# Altium project zytek_gatedrv.PRJPCB
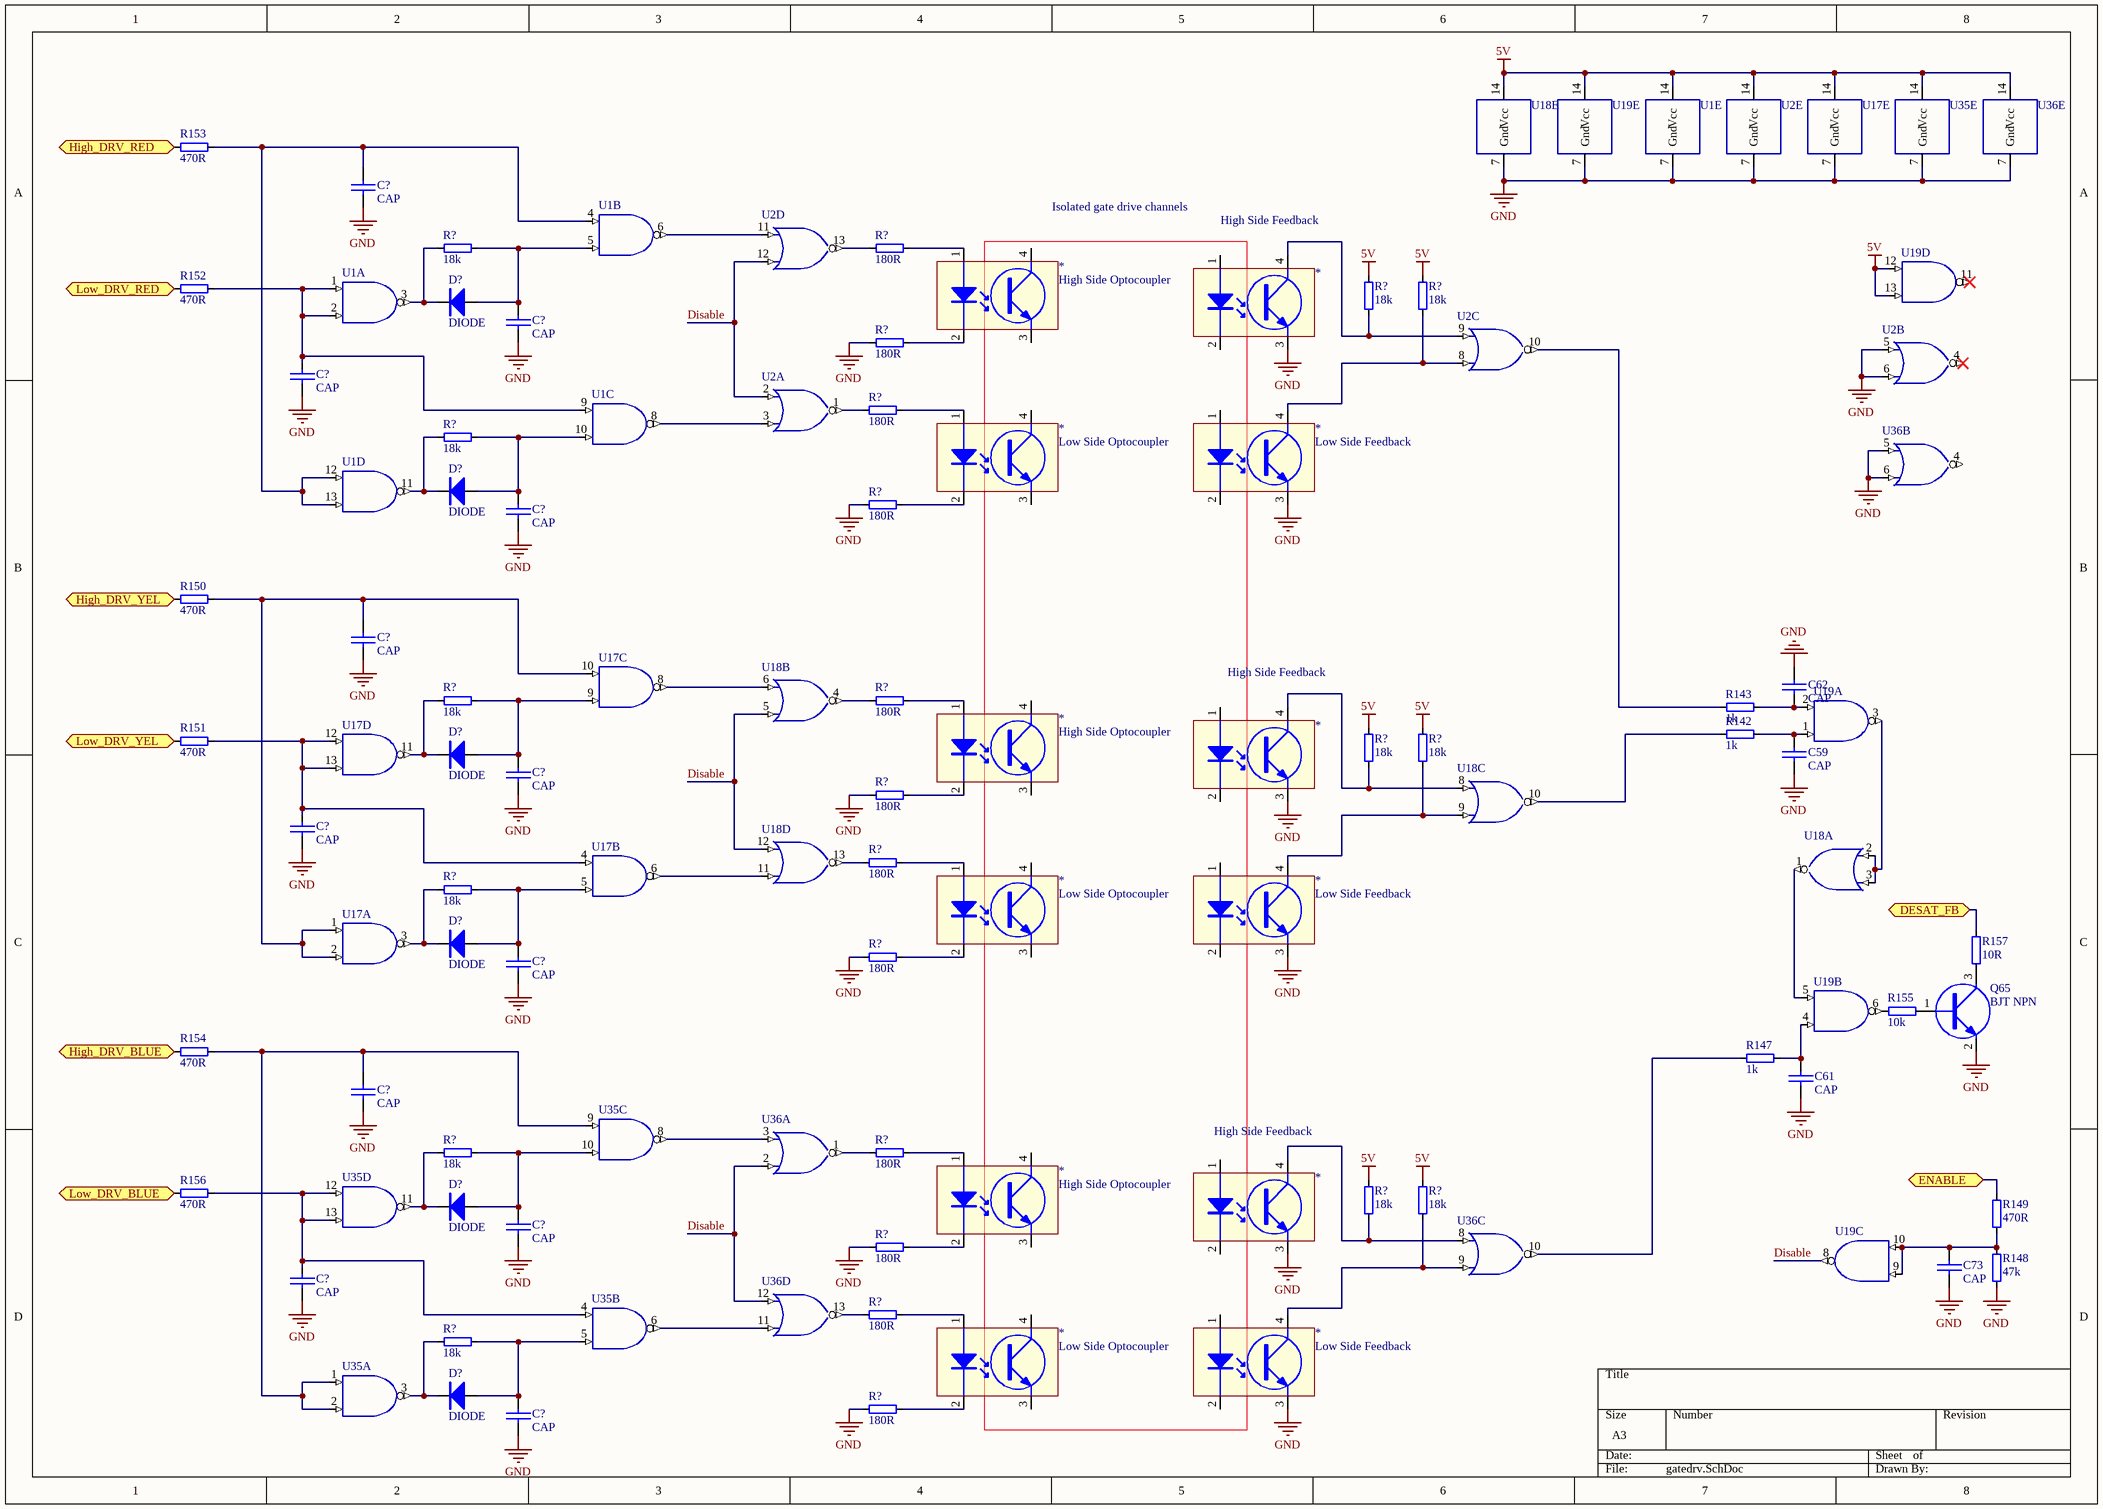
[diagram p0: gatedrv.SchDoc]
DOC_NAME: BLDC CONVERTER PCB; PCB_REV: V5.0; PROJECT_NAME: BLDC CONVERTER PCB; SCH_REV: V5.0
2 sheets, 86 parts. Net scope: flat (ports and power ports of the same name join across sheets).
Sheets:
  gatedrv.SchDoc
  connector.SchDoc

## Sheet gatedrv.SchDoc
size A3; PageSetup: Record=PageOptions|CenterHorizontal=True|CenterVertical=True|PrintScale=0.73|XCorrection=1.00|YCorrection=1.00|PrintKind=1|BorderSize=5000000|LeftOffset=0|BottomOffset=0|Orientation=2|PaperLength=1000|PaperWidth=1000|Scale=100|PaperSource=7|PrintQuality=-3|MediaType=1|DitherType=10|PrintScaleMode=1|PaperKind=A4|PaperIndex=9

### Parts
(Parts that share a designator on the sheet are numbered #1, #2 ... from top to bottom, then left to right.)
*#1  High Side Optocoupler  [4_SMD_GULLWING]
*#2  High Side Feedback  [4_SMD_GULLWING]
*#3  Low Side Optocoupler  [4_SMD_GULLWING]
*#4  Low Side Feedback  [4_SMD_GULLWING]
*#5  High Side Optocoupler  [4_SMD_GULLWING]
*#6  High Side Feedback  [4_SMD_GULLWING]
*#7  Low Side Optocoupler  [4_SMD_GULLWING]
*#8  Low Side Feedback  [4_SMD_GULLWING]
*#9  High Side Optocoupler  [4_SMD_GULLWING]
*#10  High Side Feedback  [4_SMD_GULLWING]
*#11  Low Side Optocoupler  [4_SMD_GULLWING]
*#12  Low Side Feedback  [4_SMD_GULLWING]
C59  CAP  [0402]
C61  CAP  [0402]
C62  CAP  [0402]
C73  CAP  [0402]
C?#1  CAP  [0402]
C?#2  CAP  [0402]
C?#3  CAP  [0402]
C?#4  CAP  [0402]
C?#5  CAP  [0402]
C?#6  CAP  [0402]
C?#7  CAP  [0402]
C?#8  CAP  [0402]
C?#9  CAP  [0402]
C?#10  CAP  [0402]
C?#11  CAP  [0402]
C?#12  CAP  [0402]
D?#1  DIODE  [D-0603]
D?#2  DIODE  [D-0603]
D?#3  DIODE  [D-0603]
D?#4  DIODE  [D-0603]
D?#5  DIODE  [D-0603]
D?#6  DIODE  [D-0603]
Q65  BJT NPN  [SOT23]
R142  1k  [0402]
R143  1k  [0402]
R147  1k  [0402]
R148  47k  [0402]
R149  470R  [0402]
R150  470R  [0402]
R151  470R  [0402]
R152  470R  [0402]
R153  470R  [0402]
R154  470R  [0402]
R155  10k  [0402]
R156  470R  [0402]
R157  10R  [0402]
R?#1  18k  [0402]
R?#2  180R  [0402]
R?#3  18k  [0402]
R?#4  18k  [0402]
R?#5  180R  [0402]
R?#6  180R  [0402]
R?#7  18k  [0402]
R?#8  180R  [0402]
R?#9  18k  [0402]
R?#10  180R  [0402]
R?#11  18k  [0402]
R?#12  18k  [0402]
R?#13  180R  [0402]
R?#14  180R  [0402]
R?#15  18k  [0402]
R?#16  180R  [0402]
R?#17  18k  [0402]
R?#18  180R  [0402]
R?#19  18k  [0402]
R?#20  18k  [0402]
R?#21  180R  [0402]
R?#22  180R  [0402]
R?#23  18k  [0402]
R?#24  180R  [0402]
U1  (no value)  [SO14]  (parts A,B,C,D,E of 5)
U2  (no value)  [SO14]  (parts A,B,C,D,E of 5)
U17  (no value)  [SO14]  (parts A,B,C,D,E of 5)
U18  (no value)  [SO14]  (parts A,B,C,D,E of 5)
U19  (no value)  [SO14]  (parts A,B,C,D,E of 5)
U35  (no value)  [SO14]  (parts A,B,C,D,E of 5)
U36  (no value)  [SO14]  (parts A,B,C,D,E of 5)

### Ports
DESAT_FB, ENABLE, High_DRV_BLUE, High_DRV_RED, High_DRV_YEL, Low_DRV_BLUE, Low_DRV_RED, Low_DRV_YEL

### Nets
5V: R?#3.2 R?#4.2 R?#11.2 R?#12.2 R?#19.2 R?#20.2 U1.14(Vcc) U2.14(Vcc) U17.14(Vcc) U18.14(Vcc) U19.12 U19.13 U19.14(Vcc) U35.14(Vcc) U36.14(Vcc)
GND: *#2.3 *#4.3 *#6.3 *#8.3 *#10.3 *#12.3 C59.1 C61.1 C62.2 C73.1 C?#1.1 C?#2.1 C?#3.2 C?#4.1 C?#5.1 C?#6.1 C?#7.2 C?#8.1 C?#9.1 C?#10.1 C?#11.2 C?#12.1 Q65.2(E) R148.2 R?#5.2 R?#8.2 R?#13.2 R?#16.2 R?#21.2 R?#24.2 U1.7(Gnd) U2.5 U2.6 U2.7(Gnd) U17.7(Gnd) U18.7(Gnd) U19.7(Gnd) U35.7(Gnd) U36.5 U36.6 U36.7(Gnd)
Disable: U2.2 U2.12 U18.5 U18.12 U19.8 U36.2 U36.12
Net*#1_1: *#1.1 R?#2.2
Net*#1_2: *#1.2 R?#5.1
Net*#2_4: *#2.4 R?#3.1 U2.9
Net*#3_1: *#3.1 R?#6.2
Net*#3_2: *#3.2 R?#8.1
Net*#4_4: *#4.4 R?#4.1 U2.8
Net*#5_1: *#5.1 R?#10.2
Net*#5_2: *#5.2 R?#13.1
Net*#6_4: *#6.4 R?#11.1 U18.8
Net*#7_1: *#7.1 R?#14.2
Net*#7_2: *#7.2 R?#16.1
Net*#8_4: *#8.4 R?#12.1 U18.9
Net*#9_1: *#9.1 R?#18.2
Net*#9_2: *#9.2 R?#21.1
Net*#10_4: *#10.4 R?#19.1 U36.8
Net*#11_1: *#11.1 R?#22.2
Net*#11_2: *#11.2 R?#24.1
Net*#12_4: *#12.4 R?#20.1 U36.9
NetC59_2: C59.2 R142.2 U19.1
NetC61_2: C61.2 R147.2 U19.4
NetC62_1: C62.1 R143.2 U19.2
NetC73_2: C73.2 R148.1 R149.2 U19.9 U19.10
NetC?#1_2: C?#1.2 R153.2 U1.4 U1.12 U1.13
NetC?#2_2: C?#2.2 D?#1.A R?#1.2 U1.5
NetC?#3_1: C?#3.1 R152.2 U1.1 U1.2 U1.9
NetC?#4_2: C?#4.2 D?#2.A R?#7.2 U1.10
NetC?#5_2: C?#5.2 R150.2 U17.1 U17.2 U17.10
NetC?#6_2: C?#6.2 D?#3.A R?#9.2 U17.9
NetC?#7_1: C?#7.1 R151.2 U17.4 U17.12 U17.13
NetC?#8_2: C?#8.2 D?#4.A R?#15.2 U17.5
NetC?#9_2: C?#9.2 R154.2 U35.1 U35.2 U35.9
NetC?#10_2: C?#10.2 D?#5.A R?#17.2 U35.10
NetC?#11_1: C?#11.1 R156.2 U35.4 U35.12 U35.13
NetC?#12_2: C?#12.2 D?#6.A R?#23.2 U35.5
NetD?#1_K: D?#1.K R?#1.1 U1.3
NetD?#2_K: D?#2.K R?#7.1 U1.11
NetD?#3_K: D?#3.K R?#9.1 U17.11
NetD?#4_K: D?#4.K R?#15.1 U17.3
NetD?#5_K: D?#5.K R?#17.1 U35.11
NetD?#6_K: D?#6.K R?#23.1 U35.3
NetJ1_3: R157.1 ; port DESAT_FB
NetJ1_5: R153.1 ; port High_DRV_RED
NetJ1_7: R152.1 ; port Low_DRV_RED
NetJ1_9: R151.1 ; port Low_DRV_YEL
NetJ1_11: R150.1 ; port High_DRV_YEL
NetJ1_13: R156.1 ; port Low_DRV_BLUE
NetJ1_15: R154.1 ; port High_DRV_BLUE
NetJ1_17: R149.1 ; port ENABLE
NetQ65_1: Q65.1(B) R155.1
NetQ65_3: Q65.3(C) R157.2
NetR142_1: R142.1 U18.10
NetR143_1: R143.1 U2.10
NetR147_1: R147.1 U36.10
NetR155_2: R155.2 U19.6
NetR?#2_1: R?#2.1 U2.13
NetR?#6_1: R?#6.1 U2.1
NetR?#10_1: R?#10.1 U18.4
NetR?#14_1: R?#14.1 U18.13
NetR?#18_1: R?#18.1 U36.1
NetR?#22_1: R?#22.1 U36.13
NetU1_6: U1.6 U2.11
NetU1_8: U1.8 U2.3
NetU17_6: U17.6 U18.11
NetU17_8: U17.8 U18.6
NetU18_1: U18.1 U19.5
NetU18_2: U18.2 U18.3 U19.3
NetU35_6: U35.6 U36.11
NetU35_8: U35.8 U36.3

Not connected (* = marked no-connect by the designer): *#1 3 4; *#2 1 2; *#3 3 4; *#4 1 2; *#5 3 4; *#6 1 2; *#7 3 4; *#8 1 2; *#9 3 4; *#10 1 2; *#11 3 4; *#12 1 2; U2 4*; U19 11*; U36 4

### Notes on the sheet
- (near *#1) Isolated gate drive channels

### Library data of the parts
*#1-*#12 = OPTO_COUPLE: Status: Draft
C59 C61 C62 C73 C?#1-C?#12 = CAPACITOR: Status: Draft
Q65 = BC847 - SOT23 - Draft: NPN BJ Transistor; Status: Draft
R142 R143 R147-R157 R?#1-R?#24 = RESISTOR: Parameter: *; Status: Draft
U1 U17 U19 U35 = NAND GATE QUAD: Status: Draft
U2 U18 U36 = NOR GATE QUAD: Status: Draft
D?#1-D?#6 = DIODE: Status: Draft

## Sheet connector.SchDoc
size A3; PageSetup: Record=PageOptions|CenterHorizontal=True|CenterVertical=True|PrintScale=1.00|XCorrection=1.00|YCorrection=1.00|PrintKind=1|BorderSize=5000000|LeftOffset=0|BottomOffset=0|Orientation=2|PaperLength=1000|PaperWidth=1000|Scale=100|PaperSource=7|PrintQuality=-3|MediaType=1|DitherType=10|PrintScaleMode=1|PaperKind=A4|PaperIndex=9
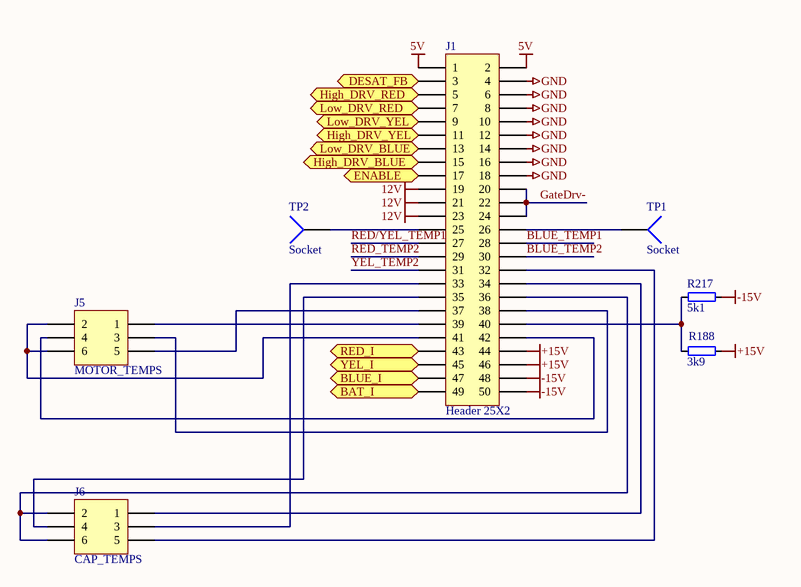
[diagram p1: connector.SchDoc]

### Parts
J1  Header 25X2  [HDR2X25]
J5  MOTOR_TEMPS  [HDR2X3]
J6  CAP_TEMPS  [HDR2X3]
R188  3k9  [0402]
R217  5k1  [0402]
TP1  Socket  [PIN1]
TP2  Socket  [PIN1]

### Ports
BAT_I, BLUE_I, DESAT_FB, ENABLE, High_DRV_BLUE, High_DRV_RED, High_DRV_YEL, Low_DRV_BLUE, Low_DRV_RED, Low_DRV_YEL, RED_I, YEL_I

### Nets
5V: J1.1 J1.2
12V: J1.19 J1.21 J1.23
+15V: J1.44 J1.46 R188.2
-15V: J1.48 J1.50 R217.2
GND: J1.4 J1.6 J1.8 J1.10 J1.12 J1.14 J1.16 J1.18
BLUE_TEMP1: J1.28
BLUE_TEMP2: J1.30
GateDrv-: J1.20 J1.22 J1.24
RED/YEL_TEMP1: J1.27
RED_TEMP2: J1.29
YEL_TEMP2: J1.31
NetJ1_3: J1.3 ; port DESAT_FB
NetJ1_5: J1.5 ; port High_DRV_RED
NetJ1_7: J1.7 ; port Low_DRV_RED
NetJ1_9: J1.9 ; port Low_DRV_YEL
NetJ1_11: J1.11 ; port High_DRV_YEL
NetJ1_13: J1.13 ; port Low_DRV_BLUE
NetJ1_15: J1.15 ; port High_DRV_BLUE
NetJ1_17: J1.17 ; port ENABLE
NetJ1_25: J1.25 TP2.1
NetJ1_26: J1.26 TP1.1
NetJ1_32: J1.32 J6.5
NetJ1_33: J1.33 J6.3
NetJ1_34: J1.34 J6.1
NetJ1_35: J1.35 J6.4
NetJ1_36: J1.36 J6.2 J6.6
NetJ1_37: J1.37 J5.5
NetJ1_38: J1.38 J5.3
NetJ1_39: J1.39 J5.1
NetJ1_40: J1.40 R188.1 R217.1
NetJ1_41: J1.41 J5.2 J5.6
NetJ1_42: J1.42 J5.4
NetJ1_43: J1.43 ; port RED_I
NetJ1_45: J1.45 ; port YEL_I
NetJ1_47: J1.47 ; port BLUE_I
NetJ1_49: J1.49 ; port BAT_I

### Library data of the parts
J1 = Header 25X2: Header, 25-Pin, Dual row; LatestRevisionDate: 17-Jul-2002; LatestRevisionNote: Re-released for DXP Platform.; Publisher: Altium Limited
J5 J6 = Header 3X2: Header, 3-Pin, Dual row; LatestRevisionDate: 17-Jul-2002; LatestRevisionNote: Re-released for DXP Platform.; Publisher: Altium Limited
R188 R217 = RESISTOR: Parameter: *; Status: Draft
TP1 TP2 = Socket: LatestRevisionDate: 17-Jul-2002; LatestRevisionNote: Re-released for DXP Platform.; Publisher: Altium Limited

## Nets that join several sheets
5V: gatedrv (15 pins), connector (J1.1 J1.2)
GND: gatedrv (41 pins), connector (8 pins)
NetJ1_3: gatedrv (R157.1), connector (J1.3)
NetJ1_5: gatedrv (R153.1), connector (J1.5)
NetJ1_7: gatedrv (R152.1), connector (J1.7)
NetJ1_9: gatedrv (R151.1), connector (J1.9)
NetJ1_11: gatedrv (R150.1), connector (J1.11)
NetJ1_13: gatedrv (R156.1), connector (J1.13)
NetJ1_15: gatedrv (R154.1), connector (J1.15)
NetJ1_17: gatedrv (R149.1), connector (J1.17)